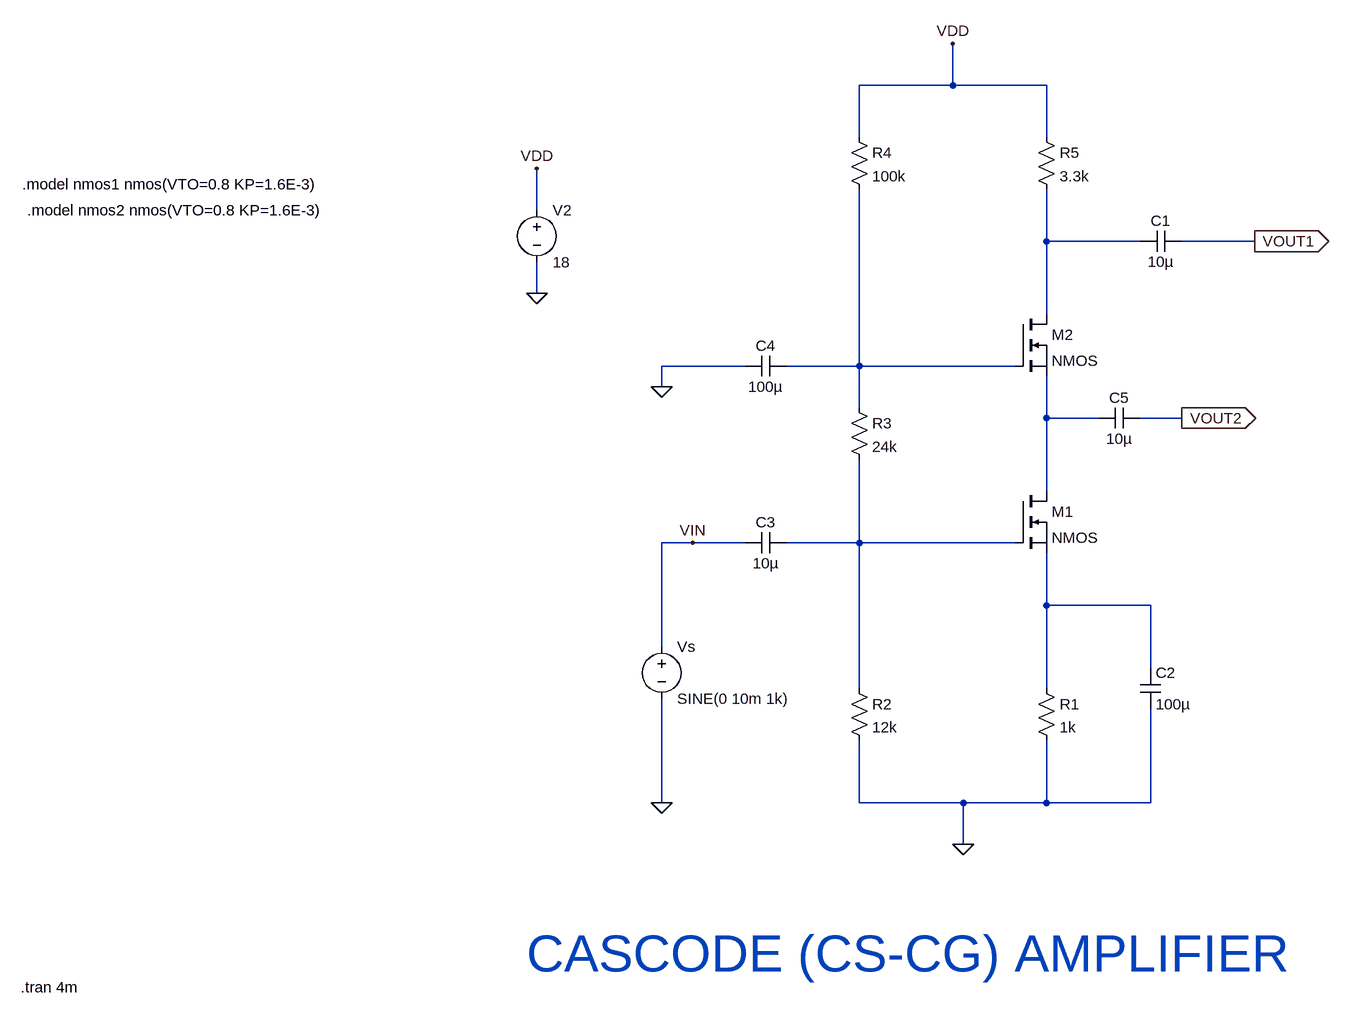
[diagram p0: schematic Cascode(CS-CG) Amplifier.asc]
Cascode(CS-CG) Amplifier.asc, the LTspice schematic file:
Version 4
SHEET 1 1068 908
WIRE 112 -496 112 -560
WIRE 112 -496 -32 -496
WIRE 256 -496 112 -496
WIRE -32 -416 -32 -496
WIRE 256 -416 256 -496
WIRE -528 -304 -528 -368
WIRE 256 -256 256 -336
WIRE 400 -256 256 -256
WIRE 576 -256 464 -256
WIRE -528 -176 -528 -224
WIRE 256 -144 256 -256
WIRE -208 -64 -336 -64
WIRE -32 -64 -32 -336
WIRE -32 -64 -144 -64
WIRE 208 -64 -32 -64
WIRE -336 -32 -336 -64
WIRE -32 0 -32 -64
WIRE 256 16 256 -48
WIRE 336 16 256 16
WIRE 464 16 400 16
WIRE 256 128 256 16
WIRE -288 208 -336 208
WIRE -208 208 -288 208
WIRE -32 208 -32 80
WIRE -32 208 -144 208
WIRE 208 208 -32 208
WIRE 256 304 256 224
WIRE 416 304 256 304
WIRE -336 368 -336 208
WIRE 416 400 416 304
WIRE -32 432 -32 208
WIRE 256 432 256 304
WIRE -336 608 -336 448
WIRE -32 608 -32 512
WIRE 128 608 -32 608
WIRE 256 608 256 512
WIRE 256 608 128 608
WIRE 416 608 416 464
WIRE 416 608 256 608
WIRE 128 672 128 608
FLAG 128 672 0
FLAG -336 -32 0
FLAG -336 608 0
FLAG 576 -256 VOUT1
IOPIN 576 -256 Out
FLAG 464 16 VOUT2
IOPIN 464 16 Out
FLAG -528 -368 VDD
FLAG 112 -560 VDD
FLAG -288 208 VIN
FLAG -528 -176 0
SYMBOL nmos 208 128 R0
SYMATTR InstName M1
SYMBOL nmos 208 -144 R0
SYMATTR InstName M2
SYMBOL res 240 416 R0
SYMATTR InstName R1
SYMATTR Value 1k
SYMBOL res -48 416 R0
SYMATTR InstName R2
SYMATTR Value 12k
SYMBOL res -48 -16 R0
SYMATTR InstName R3
SYMATTR Value 24k
SYMBOL res -48 -432 R0
SYMATTR InstName R4
SYMATTR Value 100k
SYMBOL res 240 -432 R0
SYMATTR InstName R5
SYMATTR Value 3.3k
SYMBOL cap 400 -240 R270
WINDOW 0 32 32 VTop 2
WINDOW 3 0 32 VBottom 2
SYMATTR InstName C1
SYMATTR Value 10µ
SYMBOL cap 400 400 R0
SYMATTR InstName C2
SYMATTR Value 100µ
SYMBOL cap -144 192 R90
WINDOW 0 0 32 VBottom 2
WINDOW 3 32 32 VTop 2
SYMATTR InstName C3
SYMATTR Value 10µ
SYMBOL cap -144 -80 R90
WINDOW 0 0 32 VBottom 2
WINDOW 3 32 32 VTop 2
SYMATTR InstName C4
SYMATTR Value 100µ
SYMBOL cap 400 0 R90
WINDOW 0 0 32 VBottom 2
WINDOW 3 32 32 VTop 2
SYMATTR InstName C5
SYMATTR Value 10µ
SYMBOL voltage -336 352 R0
WINDOW 123 0 0 Left 0
WINDOW 39 0 0 Left 0
SYMATTR InstName Vs
SYMATTR Value SINE(0 10m 1k)
SYMBOL voltage -528 -320 R0
WINDOW 123 0 0 Left 0
WINDOW 39 0 0 Left 0
SYMATTR InstName V2
SYMATTR Value 18
TEXT -544 840 Left 6 ;CASCODE (CS-CG) AMPLIFIER
TEXT -1320 -344 Left 2 !.model nmos1 nmos(VTO=0.8 KP=1.6E-3)
TEXT -1312 -304 Left 2 !.model nmos2 nmos(VTO=0.8 KP=1.6E-3)
TEXT -1322 892 Left 2 !.tran 4m

The netlist it stands for:
* Cascode(CS-CG) Amplifier.asc
M1 N003 N004 N005 N005 NMOS
M2 N001 N002 N003 N003 NMOS
R1 N005 0 1k
R2 N004 0 12k
R3 N002 N004 24k
R4 VDD N002 100k
R5 VDD N001 3.3k
C1 N001 VOUT1 10µ
C2 N005 0 100µ
C3 N004 VIN 10µ
C4 N002 0 100µ
C5 VOUT2 N003 10µ
Vs VIN 0 SINE(0 10m 1k)
V2 VDD 0 18
.model NMOS NMOS
.model PMOS PMOS
.lib standard.mos
* CASCODE (CS-CG) AMPLIFIER
.model nmos1 nmos(VTO=0.8 KP=1.6E-3)
.model nmos2 nmos(VTO=0.8 KP=1.6E-3)
.tran 4m
.backanno
.end